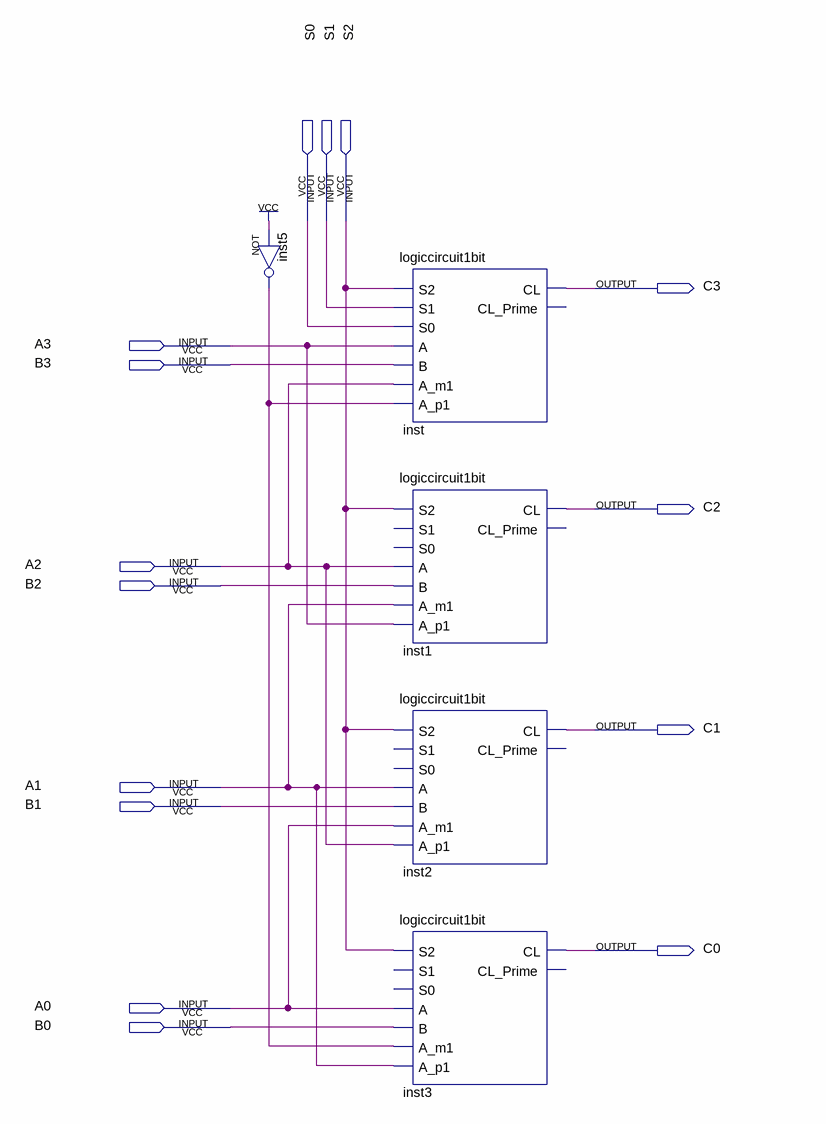
[diagram p0: schematic sheet]
// Quartus schematic logiccircuit4bit.bdf as structural Verilog: 5 symbols, 15 pins
module logiccircuit4bit (
  input  S0,
  input  S1,
  input  S2,
  input  A3,
  input  B3,
  input  A2,
  input  B2,
  input  A1,
  input  B1,
  input  A0,
  input  B0,
  output C3,
  output C2,
  output C1,
  output C0
);

  wire inst5_out;

  not inst5 (inst5_out, 1'b1);
  logiccircuit1bit inst (
    .S2(S2), .S1(S1), .S0(S0), .A(A3), .B(B3), .A_m1(A2), .A_p1(inst5_out), .CL(C3));  // open: CL_Prime
  logiccircuit1bit inst1 (.S2(S2), .A(A2), .B(B2), .A_m1(A1), .A_p1(A3), .CL(C2));  // open: S1, S0, CL_Prime
  logiccircuit1bit inst2 (.S2(S2), .A(A1), .B(B1), .A_m1(A0), .A_p1(A2), .CL(C1));  // open: S1, S0, CL_Prime
  logiccircuit1bit inst3 (.S2(S2), .A(A0), .B(B0), .A_m1(inst5_out), .A_p1(A1), .CL(C0));  // open: S1, S0, CL_Prime
endmodule
